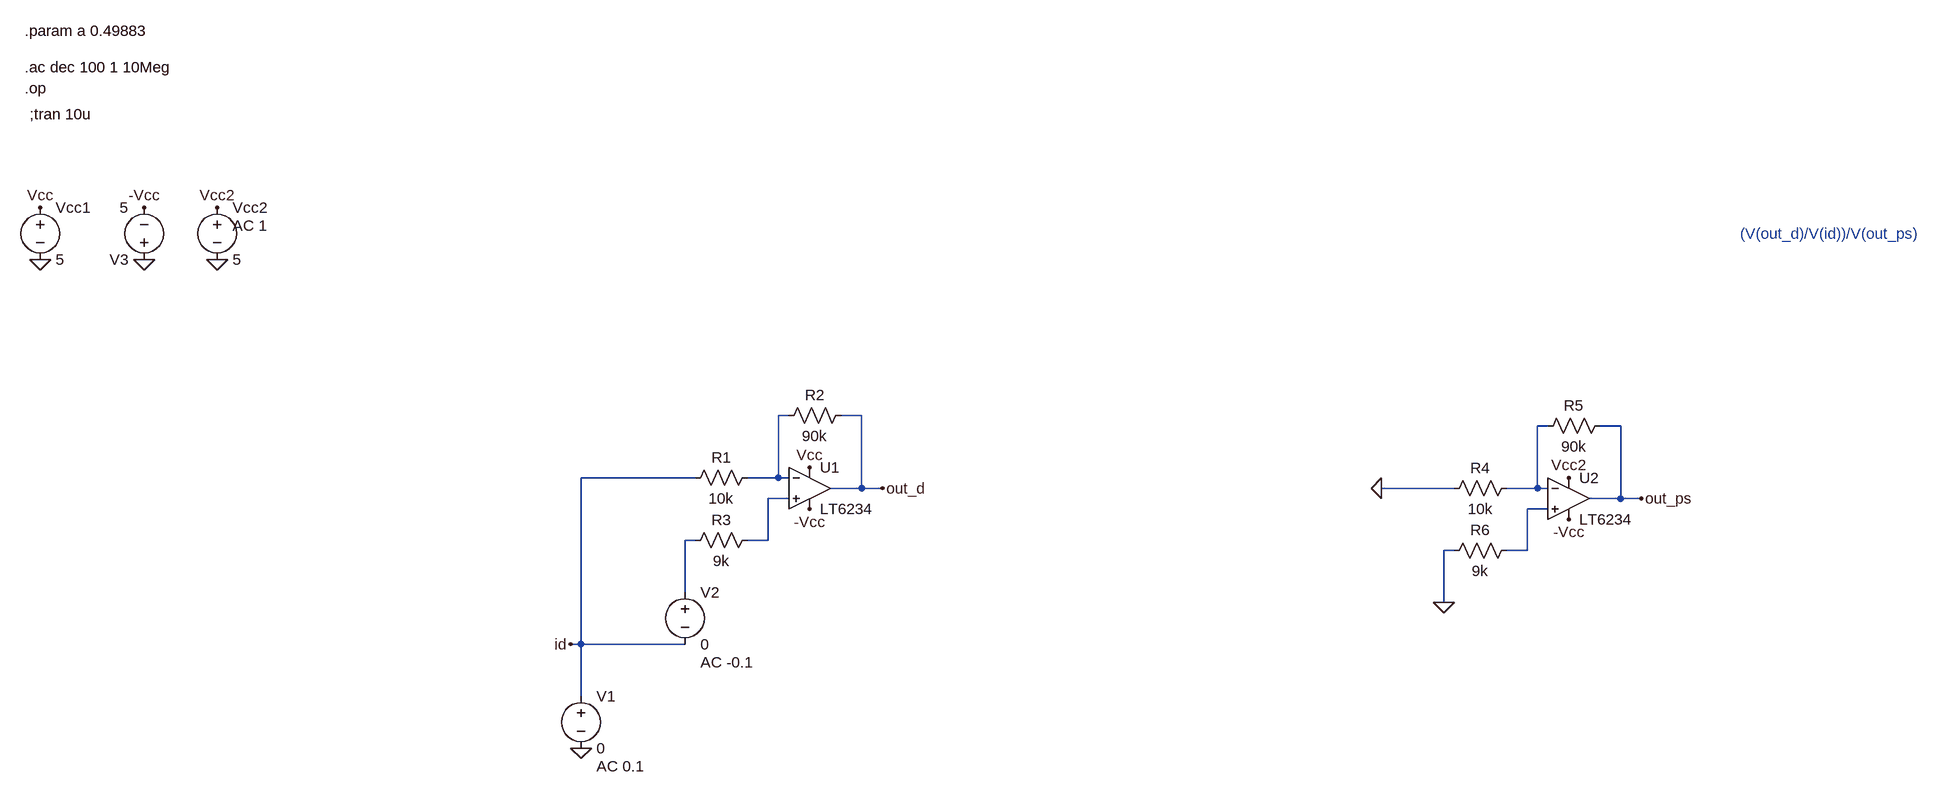
[diagram p0: schematic PSRR.asc]
PSRR.asc, the LTspice schematic file:
Version 4
SHEET 1 1688 680
WIRE -224 -80 -240 -80
WIRE -112 -80 -144 -80
WIRE 944 -64 928 -64
WIRE 1056 -64 1024 -64
WIRE -368 16 -544 16
WIRE -240 16 -240 -80
WIRE -240 16 -288 16
WIRE -224 16 -240 16
WIRE -112 32 -112 -80
WIRE -112 32 -160 32
WIRE -80 32 -112 32
WIRE 800 32 688 32
WIRE 928 32 928 -64
WIRE 928 32 880 32
WIRE 944 32 928 32
WIRE -224 48 -256 48
WIRE 1056 48 1056 -64
WIRE 1056 48 1008 48
WIRE 1088 48 1056 48
WIRE 944 64 912 64
WIRE -368 112 -384 112
WIRE -256 112 -256 48
WIRE -256 112 -288 112
WIRE 800 128 784 128
WIRE 912 128 912 64
WIRE 912 128 880 128
WIRE -384 192 -384 112
WIRE 784 208 784 128
WIRE -544 272 -544 16
WIRE -544 272 -560 272
WIRE -384 272 -544 272
WIRE -544 352 -544 272
FLAG -192 0 Vcc
FLAG -192 64 -Vcc
FLAG -544 432 0
FLAG -80 32 out_d
FLAG -560 272 id
FLAG -1376 -320 0
FLAG -1216 -320 0
FLAG -1376 -400 Vcc
FLAG -1216 -400 -Vcc
FLAG 976 16 Vcc2
FLAG 976 80 -Vcc
FLAG 1088 48 out_ps
FLAG 784 208 0
FLAG -1104 -320 0
FLAG -1104 -400 Vcc2
FLAG 688 32 0
SYMBOL OpAmps\\LT6234 -192 32 R0
SYMATTR InstName U1
SYMBOL res -272 0 R90
WINDOW 0 0 56 VBottom 2
WINDOW 3 32 56 VTop 2
SYMATTR InstName R1
SYMATTR Value 10k
SYMBOL res -128 -96 R90
WINDOW 0 0 56 VBottom 2
WINDOW 3 32 56 VTop 2
SYMATTR InstName R2
SYMATTR Value 90k
SYMBOL res -272 96 R90
WINDOW 0 0 56 VBottom 2
WINDOW 3 32 56 VTop 2
SYMATTR InstName R3
SYMATTR Value 9k
SYMBOL voltage -544 336 R0
WINDOW 123 24 124 Left 2
WINDOW 39 0 0 Left 0
SYMATTR Value2 AC 0.1
SYMATTR InstName V1
SYMATTR Value 0
SYMBOL voltage -384 176 R0
WINDOW 123 24 124 Left 2
WINDOW 39 0 0 Left 0
SYMATTR Value2 AC -0.1
SYMATTR InstName V2
SYMATTR Value 0
SYMBOL voltage -1376 -416 R0
WINDOW 123 0 0 Left 0
WINDOW 39 0 0 Left 0
SYMATTR InstName Vcc1
SYMATTR Value 5
SYMBOL voltage -1216 -304 R180
WINDOW 123 0 0 Left 0
WINDOW 39 0 0 Left 0
SYMATTR InstName V3
SYMATTR Value 5
SYMBOL OpAmps\\LT6234 976 48 R0
SYMATTR InstName U2
SYMBOL res 896 16 R90
WINDOW 0 0 56 VBottom 2
WINDOW 3 32 56 VTop 2
SYMATTR InstName R4
SYMATTR Value 10k
SYMBOL res 1040 -80 R90
WINDOW 0 0 56 VBottom 2
WINDOW 3 32 56 VTop 2
SYMATTR InstName R5
SYMATTR Value 90k
SYMBOL res 896 112 R90
WINDOW 0 0 56 VBottom 2
WINDOW 3 32 56 VTop 2
SYMATTR InstName R6
SYMATTR Value 9k
SYMBOL voltage -1104 -416 R0
WINDOW 123 24 44 Left 2
WINDOW 39 0 0 Left 0
SYMATTR Value2 AC 1
SYMATTR InstName Vcc2
SYMATTR Value 5
TEXT -1400 -616 Left 2 !.ac dec 100 1 10Meg
TEXT -1400 -584 Left 2 !.op
TEXT -1392 -544 Left 2 !;tran 10u
TEXT -1400 -672 Left 2 !.param a 0.49883
TEXT 1240 -360 Left 2 ;(V(out_d)/V(id))/V(out_ps)

The netlist it stands for:
* PSRR.asc
* U1: LT6234 (symbol OpAmps\LT6234 not available, pins judged from their places): In+=N003 In-=N001 V+=Vcc V-=-Vcc OUT=out_d
R1 N001 id 10k
R2 out_d N001 90k
R3 N003 N005 9k
V1 id 0 0 AC 0.1
V2 N005 id 0 AC -0.1
Vcc1 Vcc 0 5
V3 0 -Vcc 5
* U2: LT6234 (symbol OpAmps\LT6234 not available, pins judged from their places): In+=N004 In-=N002 V+=Vcc2 V-=-Vcc OUT=out_ps
R4 N002 0 10k
R5 out_ps N002 90k
R6 N004 0 9k
Vcc2 Vcc2 0 5 AC 1
.ac dec 100 1 10Meg
.op
;tran 10u
.param a 0.49883
* (V(out_d)/V(id))/V(out_ps)
.backanno
.end